# Altium schematic sheet MY_beamControl_R_对外接口.SchDoc
size A4
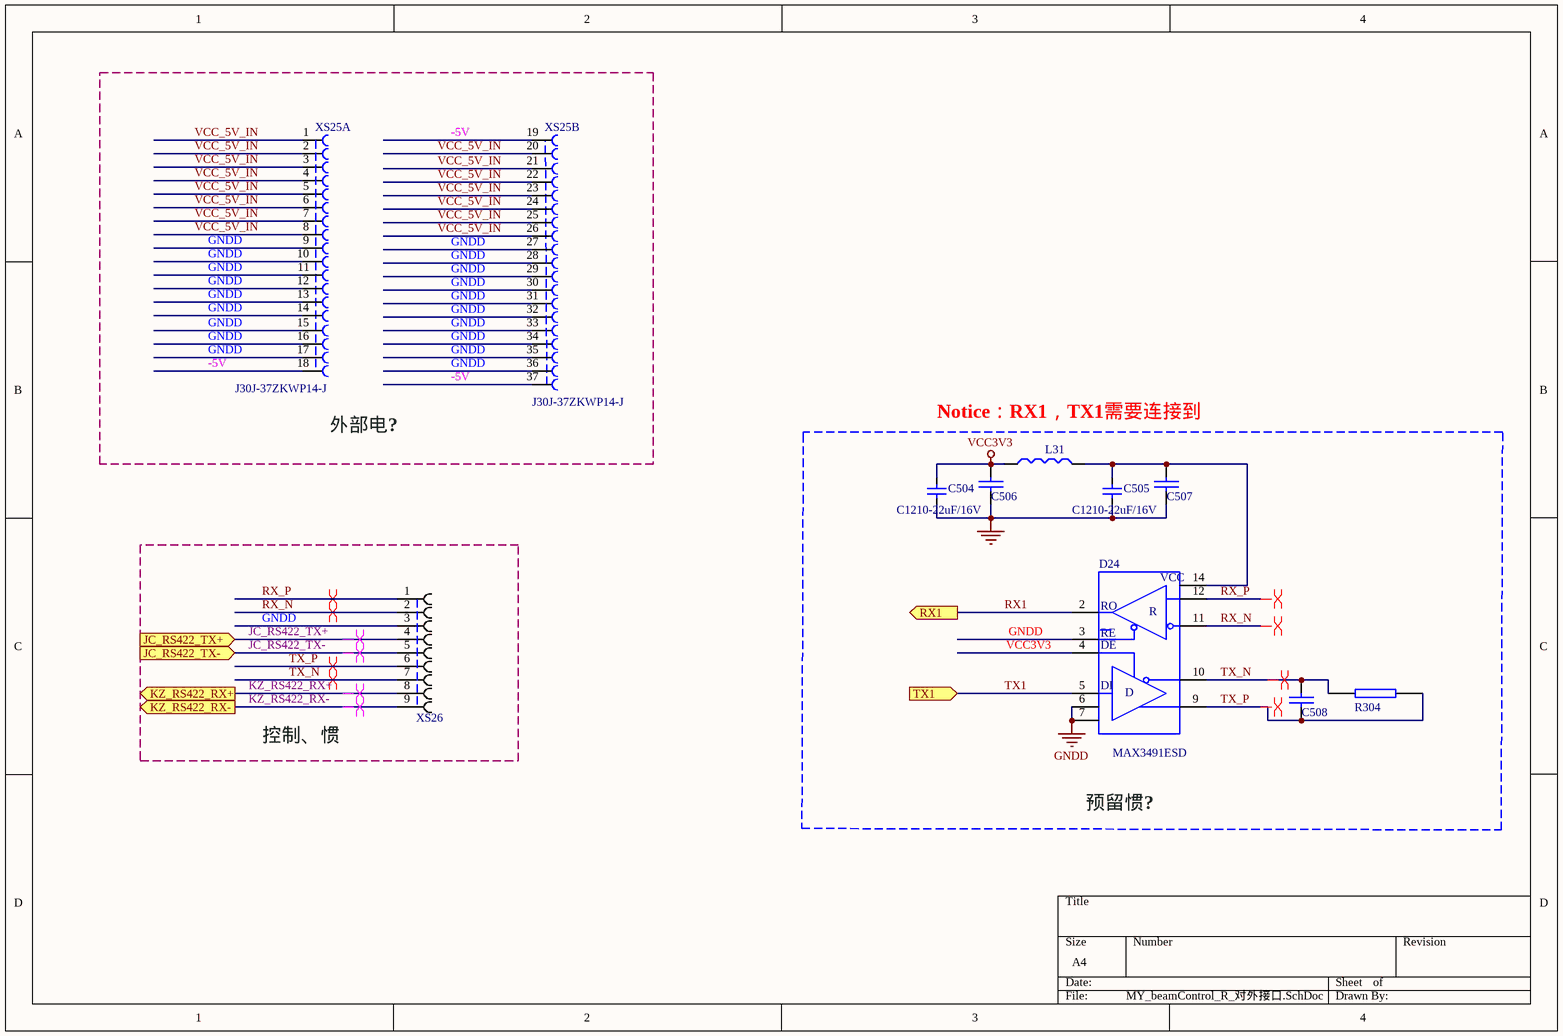
[diagram p0: MY_beamControl_R_对外接口.SchDoc]

## Parts
C504  C1210-22uF/16V  [C1210]
C505  C1210-22uF/16V  [C1210]
C506  C0402-0.1uF/16V  [c0402]  (value not drawn)
C507  C0402-0.1uF/16V  [c0402]  (value not drawn)
C508  C0402-0.1uF/16V  [c0402]  (value not drawn)
D24  MAX3491ESD  [SO-14]
L31  MPZ2012S101A  [R0805]  (value not drawn)
R304  0603-121(120Ω)  [R0603]  (value not drawn)
XS25  J30J-37ZKWP14-J  [J30J-37ZKWP14]  (parts A,B of 2)
XS26  J30J-9ZKWP7-J(成套订购)  [J30J-9ZKWP7-J]  (value not drawn)

## Blocks framed on the sheet
外部电?: XS25
控制、惯: XS26

## Ports
JC_RS422_TX+ (in), JC_RS422_TX- (in), KZ_RS422_RX+ (out), KZ_RS422_RX- (out), RX1 (out), TX1 (in)

## Nets
GNDD: C504.2 C505.2 C506.2 C507.2 D24.3 D24.6 D24.7(GND) XS25.9 XS25.10 XS25.11 XS25.12 XS25.13 XS25.14 XS25.15 XS25.16 XS25.17 XS25.27 XS25.28 XS25.29 XS25.30 XS25.31 XS25.32 XS25.33 XS25.34 XS25.35 XS25.36 XS26.3
VCC3V3: C504.1 C506.1 D24.4 L31.1
-5V: XS25.18 XS25.19 XS25.37
JC_RS422_TX+: XS26.4 ; port JC_RS422_TX+
JC_RS422_TX-: XS26.5 ; port JC_RS422_TX-
KZ_RS422_RX+: XS26.8 ; port KZ_RS422_RX+
KZ_RS422_RX-: XS26.9 ; port KZ_RS422_RX-
RX1: D24.2 ; port RX1
RX_N: D24.11 XS26.2
RX_P: D24.12 XS26.1
TX1: D24.5 ; port TX1
TX_N: C508.1 D24.10 R304.2 XS26.7
TX_P: C508.2 D24.9 R304.1 XS26.6
VCC_5V_IN: XS25.1 XS25.2 XS25.3 XS25.4 XS25.5 XS25.6 XS25.7 XS25.8 XS25.20 XS25.21 XS25.22 XS25.23 XS25.24 XS25.25 XS25.26
NetC505_1: C505.1 C507.1 D24.14(VCC) L31.2

## Layout directives
differential pair: JC_RS422_TX+, JC_RS422_TX-, KZ_RS422_RX+, KZ_RS422_RX-, RX_N, RX_P, TX_N, TX_P

## Notes on the sheet
- Notice：RX1，TX1需要连接到
- 预留惯?
- (in symbol MAX1482) RO; R; RE; DE; DI; D

## Library data of the parts
C506-C508 = C_2
D24 = MAX1482: Part Field 1: 6
L31 = ProE2A0.TMP_UnNamed_1
R304 = RES2
XS25 = 37PIN
XS26 = D: 9芯D型连接器
C504 C505 = C1210-22uF/16V: Part_number: C1210-22uF/16V; Part_type: CAP; Value: C1210-22uF/16V; Schematic_Part: CAP; PCB_Footprint: C1210